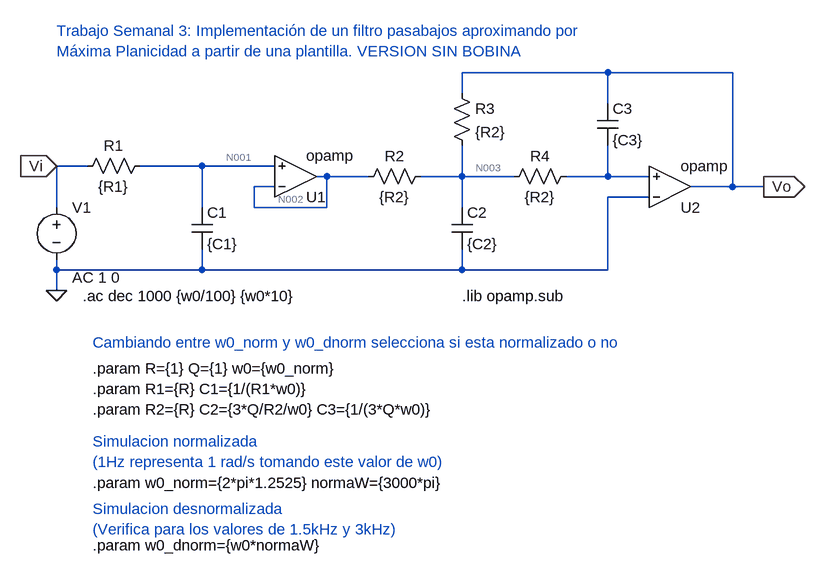
[diagram p0: schematic butter_lp_sin_bobinas.asc]
butter_lp_sin_bobinas.asc, the LTspice schematic file:
Version 4
SHEET 1 1196 1168
WIRE 864 96 640 96
WIRE 1056 96 864 96
WIRE 640 128 640 96
WIRE 864 144 864 96
WIRE 64 240 16 240
WIRE 240 240 144 240
WIRE 352 240 240 240
WIRE 432 256 416 256
WIRE 496 256 432 256
WIRE 640 256 640 208
WIRE 640 256 576 256
WIRE 720 256 640 256
WIRE 864 256 864 208
WIRE 864 256 800 256
WIRE 928 256 864 256
WIRE 352 272 320 272
WIRE 1056 272 1056 96
WIRE 1056 272 992 272
WIRE 1104 272 1056 272
WIRE 928 288 864 288
WIRE 16 304 16 240
WIRE 240 304 240 240
WIRE 320 304 320 272
WIRE 432 304 432 256
WIRE 432 304 320 304
WIRE 640 304 640 256
WIRE 16 400 16 384
WIRE 240 400 240 368
WIRE 240 400 16 400
WIRE 640 400 640 368
WIRE 640 400 240 400
WIRE 864 400 864 288
WIRE 864 400 640 400
WIRE 16 432 16 400
FLAG 16 432 0
FLAG 16 240 Vi
IOPIN 16 240 In
FLAG 1104 272 Vo
IOPIN 1104 272 Out
SYMBOL res 160 224 R90
WINDOW 0 0 56 VBottom 2
WINDOW 3 32 56 VTop 2
SYMATTR InstName R1
SYMATTR Value {R1}
SYMBOL cap 224 304 R0
SYMATTR InstName C1
SYMATTR Value {C1}
SYMBOL voltage 16 288 R0
WINDOW 123 24 124 Left 2
WINDOW 39 0 0 Left 0
SYMATTR Value2 AC 1 0
SYMATTR InstName V1
SYMATTR Value ""
SYMBOL res 592 240 R90
WINDOW 0 0 56 VBottom 2
WINDOW 3 32 56 VTop 2
SYMATTR InstName R2
SYMATTR Value {R2}
SYMBOL cap 624 304 R0
SYMATTR InstName C2
SYMATTR Value {C2}
SYMBOL OpAmps\\opamp 384 320 M180
SYMATTR InstName U1
SYMBOL res 624 112 R0
SYMATTR InstName R3
SYMATTR Value {R2}
SYMBOL res 816 240 R90
WINDOW 0 0 56 VBottom 2
WINDOW 3 32 56 VTop 2
SYMATTR InstName R4
SYMATTR Value {R2}
SYMBOL cap 848 144 R0
SYMATTR InstName C3
SYMATTR Value {C3}
SYMBOL OpAmps\\opamp 960 336 M180
SYMATTR InstName U2
TEXT 56 440 Left 2 !.ac dec 1000 {w0/100} {w0*10}
TEXT 72 552 Left 2 !.param R={1} Q={1} w0={w0_norm}\n.param R1={R} C1={1/(R1*w0)}\n.param R2={R} C2={3*Q/R2/w0} C3={1/(3*Q*w0)}
TEXT 640 440 Left 2 !.lib opamp.sub
TEXT 16 32 Left 2 ;Trabajo Semanal 3: Implementación de un filtro pasabajos aproximando por\nMáxima Planicidad a partir de una plantilla. VERSION SIN BOBINA
TEXT 72 512 Left 2 ;Cambiando entre w0_norm y w0_dnorm selecciona si esta normalizado o no
TEXT 72 728 Left 2 !.param w0_norm={2*pi*1.2525} normaW={3000*pi}
TEXT 72 664 Left 2 ;Simulacion normalizada\n(1Hz representa 1 rad/s tomando este valor de w0)
TEXT 72 768 Left 2 ;Simulacion desnormalizada\n(Verifica para los valores de 1.5kHz y 3kHz)
TEXT 72 824 Left 2 !.param w0_dnorm={w0*normaW}

The netlist it stands for:
* butter_lp_sin_bobinas.asc
R1 N001 Vi {R1}
C1 N001 0 {C1}
V1 Vi 0 AC 1 0
R2 N003 N002 {R2}
C2 N003 0 {C2}
XU1 N002 N001 N002 opamp Aol=100K GBW=10Meg  ; pins invin noninvin out
R3 Vo N003 {R2}
R4 N004 N003 {R2}
C3 Vo N004 {C3}
XU2 0 N004 Vo opamp Aol=100K GBW=10Meg  ; pins invin noninvin out
.ac dec 1000 {w0/100} {w0*10}
.param R={1} Q={1} w0={w0_norm}
.param R1={R} C1={1/(R1*w0)}
.param R2={R} C2={3*Q/R2/w0} C3={1/(3*Q*w0)}
.lib opamp.sub
* Trabajo Semanal 3: Implementación de un filtro pasabajos aproximando por
* Máxima Planicidad a partir de una plantilla. VERSION SIN BOBINA
* Cambiando entre w0_norm y w0_dnorm selecciona si esta normalizado o no
.param w0_norm={2*pi*1.2525} normaW={3000*pi}
* Simulacion normalizada
* (1Hz representa 1 rad/s tomando este valor de w0)
* Simulacion desnormalizada
* (Verifica para los valores de 1.5kHz y 3kHz)
.param w0_dnorm={w0*normaW}
.backanno
.end

* Results of the author's LTspice run, read from the files saved beside the schematic
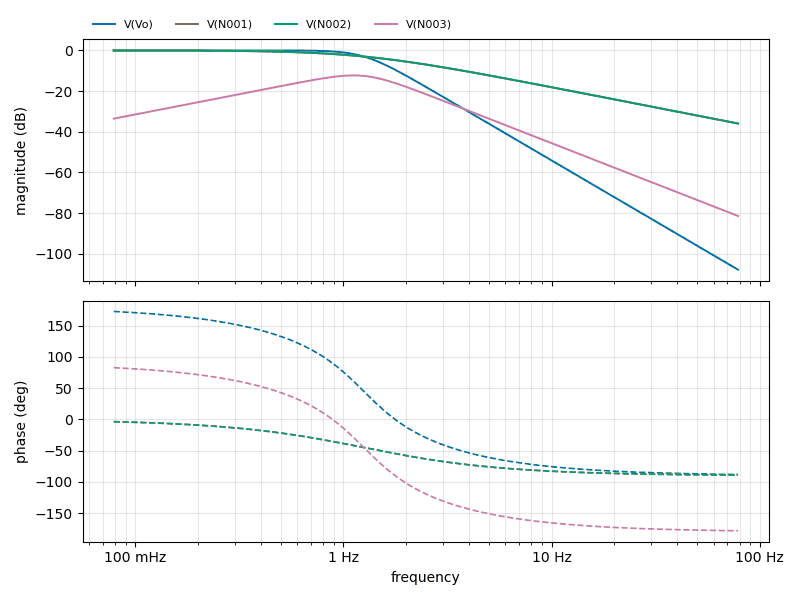
[diagram p1: AC Analysis of butter_lp_sin_bobinas.asc, plotted from the saved traces]
* AC Analysis, 1 run:
*   V(Vo): 0.00 dB at 78.7 mHz, -107.89 dB at 78.7 Hz, peak 0.00 dB at 95.27 mHz, 3 dB below the peak at 1.253 Hz
*   V(N001): -0.02 dB at 78.7 mHz, -35.96 dB at 78.7 Hz, peak -0.02 dB at 78.7 mHz, 3 dB below the peak at 1.257 Hz
*   V(N002): -0.02 dB at 78.7 mHz, -35.96 dB at 78.7 Hz, peak -0.02 dB at 78.7 mHz, 3 dB below the peak at 1.257 Hz
*   V(N003): -33.58 dB at 78.7 mHz, -81.47 dB at 78.7 Hz, peak -12.31 dB at 1.117 Hz, 3 dB below the peak at 650.5 mHz and 1.678 Hz